# Altium schematic sheet Power supply and management.SchDoc
size A4; SheetNumber: 5; SheetTotal: 6
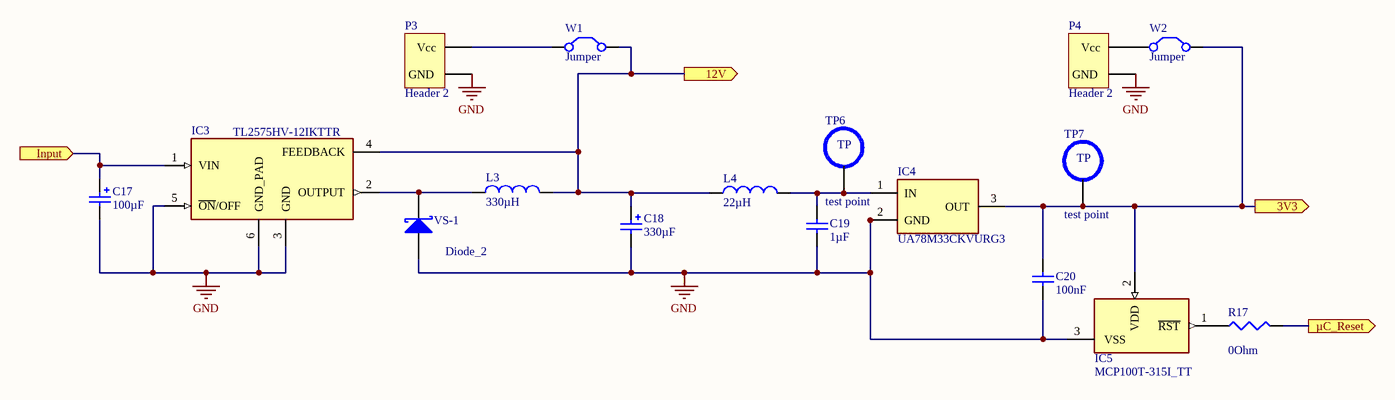
[diagram p0: Power supply and management.SchDoc]

## Parts
C17  100µF  [EEE0JA471UAP]
C18  330µF  [EEE0JA471UAP]
C19  1µF  [CAPC3216X180N]
C20  100nF  [CAPC3216X180N]
IC3  TL2575HV-12IKTTR  [TO170P1524X483-6N]
IC4  UA78M33CKVURG3  [TPS7A6533QKVURQ1]
IC5  MCP100T-315I_TT  [SOT96P237X112-3N]
L3  330µH  [B82464G4105M000]
L4  22µH  [INDPM6965X300N]
P3  Header 2  [HDR1X2]
P4  Header 2  [HDR1X2]
R17  value 0Ohm  [J1-0603]  (hidden comment: Res3)
TP6  test point  [Test point]
TP7  test point  [Test point]
VS-1  Diode_2  [DIOM5436X244N]
W1  Jumper  [RAD-0.2]
W2  Jumper  [RAD-0.2]

## Ports
3V3 (out), 12V (out), Input (in), µC_Reset (out)

## Nets
GND: C17.2 C18.2 C19.1 C20.1 IC3.3(GND) IC3.5(~{ON}/OFF) IC3.6(GND_PAD) IC4.2(GND) IC5.3(VSS) P3.?2(GND) P4.?2(GND) VS-1.3(A)
3V3: C20.2 IC4.3(OUT) IC5.2(VDD) TP7.5 W2.2(C2) ; port 3V3
12V: C18.1 IC3.4(FEEDBACK) L3.2 L4.1 W1.2(C2) ; port 12V
Input: C17.1 IC3.1(VIN) ; port Input
µC_Reset: R17.2 ; port µC_Reset
NetC19_2: C19.2 IC4.1(IN) L4.2 TP6.5
NetIC3_2: IC3.2(OUTPUT) L3.1 VS-1.1(K)
NetIC5_1: IC5.1(~{RST}) R17.1
NetP3_?1: P3.?1(Vcc) W1.1(C1)
NetP4_?1: P4.?1(Vcc) W2.1(C1)

## Notes on the sheet
- (in symbol test point) TP

## Library data of the parts
C17 = 100µF: Capacitor Polarised; Manufacturer_Name: Panasonic; Manufacturer_Part_Number: EEV-FK1K101V; Datasheet Link: http://industrial.panasonic.com/cdbs/www-data/pdf/RDE0000/ABA0000C1181.pdf; Height: 14.3mm; Mouser Part Number: 667-EEV-FK1K101V; Mouser Price/Stock: https://www.mouser.co.uk/ProductDetail/Panasonic/EEV-FK1K101V?qs=MtOUKumLmnbTFvRMlB7%2FdA%3D%3D; Value: 100µF
C18 = 330µF: Capacitor Polarised; Manufacturer_Name: Panasonic; Manufacturer_Part_Number: EEV-FK1K101V; Datasheet Link: http://industrial.panasonic.com/cdbs/www-data/pdf/RDE0000/ABA0000C1181.pdf; Height: 14.3mm; Mouser Part Number: 667-EEV-FK1K101V; Mouser Price/Stock: https://www.mouser.co.uk/ProductDetail/Panasonic/EEV-FK1K101V?qs=MtOUKumLmnbTFvRMlB7%2FdA%3D%3D; Value: 330µF
C19 = 1µF: Capacitor; Published: 8-Jun-2000; LatestRevisionDate: 17-Jul-2002; LatestRevisionNote: Re-released for DXP Platform.; PackageReference: RAD-0.3; Publisher: Altium Limited; PackageDescription: Radial Cap, Thru-Hole; 2 Leads; 0.3 in Pin Spacing; Value: 1µF
C20 = 100nF: Capacitor; Published: 8-Jun-2000; LatestRevisionDate: 17-Jul-2002; LatestRevisionNote: Re-released for DXP Platform.; PackageReference: RAD-0.3; Publisher: Altium Limited; PackageDescription: Radial Cap, Thru-Hole; 2 Leads; 0.3 in Pin Spacing; Value: 100nF
IC3 = TL2575HV-12IKTTR: Integrated Circuit; Manufacturer_Name: Texas Instruments; Datasheet Link: http://www.ti.com/lit/ds/symlink/tl2575-15.pdf; Height: 5.13mm; Manufacturer_Part_Number: TL2575HV-12IKTTR; Mouser Part Number: 595-TL2575HV-12IKTTR; Mouser Price/Stock: https://www.mouser.co.uk/ProductDetail/Texas-Instruments/TL2575HV-12IKTTR?qs=EnLMdcWnKADDmW7d51Om1g%3D%3D; Arrow Part Number: TL2575HV-12IKTTR; Arrow Price/Stock: https://www.arrow.com/en/products/tl2575hv-12ikttr/texas-instruments?region=nac
IC4 = UA78M33CKVURG3: Integrated Circuit; Manufacturer_Name: Texas Instruments; Datasheet Link: https://www.ti.com/lit/gpn/ua78m?HQS=ti-null-null-sf-df-pf-sep-wwe&DCM=yes; Height: 2.52mm; Manufacturer_Part_Number: UA78M33CKVURG3; Mouser Part Number: 595-UA78M33CKVURG3; Mouser Price/Stock: https://www.mouser.co.uk/ProductDetail/Texas-Instruments/UA78M33CKVURG3?qs=0O%2FZFlpUpJXrDg4gfD1Q2g%3D%3D; Arrow Part Number: UA78M33CKVURG3; Arrow Price/Stock: https://www.arrow.com/en/products/ua78m33ckvurg3/texas-instruments
IC5 = MCP100T-315I_TT: Integrated Circuit; Manufacturer_Name: Microchip; Manufacturer_Part_Number: MCP100T-315I/TT; Datasheet Link: http://docs-emea.rs-online.com/webdocs/0d03/0900766b80d034b8.pdf; Height: 1.12mm; Mouser Part Number: 579-MCP100T-315I/TT; Mouser Price/Stock: https://www.mouser.co.uk/ProductDetail/Microchip-Technology/MCP100T-315I-TT?qs=cQYLKLPzRJnnE4Sa6znIFg%3D%3D; Arrow Part Number: MCP100T-315I/TT; Arrow Price/Stock: https://www.arrow.com/en/products/mcp100t-315itt/microchip-technology?region=nac
L3 = 330µH: power inductor
L4 = 22µH: power inductor
P3 P4 = Header 2: Header, 2-Pin; LatestRevisionDate: 17-Jul-2002; LatestRevisionNote: Re-released for DXP Platform.; Publisher: Altium Limited
R17 = Res3: Resistor; Published: 8-Jun-2000; LatestRevisionDate: 29-May-2009; LatestRevisionNote: IPC-7351 Footprint Added.; PackageReference: J1-0603; Publisher: Altium Limited; PackageDescription: Chip Resistor
VS-1 = Diode_2: Schottky Rectifier / VS-10BQ060-M3/5BT; Note: Terminal 2 is the TAB and is electrically connected to the cathode; Published: 8-Jun-2000; LatestRevisionDate: 17-Jul-2002; LatestRevisionNote: Re-released for DXP Platform.; DatasheetVersion: PD-2.057B; PackageVersion: Feb-1998; PackageReference: TO-220AC; Publisher: Altium Limited; PackageDescription: TO, Thru-Hole, Vertical, Heatsink Mounted; 3 In-Line Leads (1 Absent); Pitch 2.54 mm; ComponentLink1Description: Manufacturer Link; ComponentLink1URL: http://www.irf.com/; ComponentLink2Description: Datasheet; ComponentLink2URL: http://www.irf.com/product-info/datasheets/data/10tq.pdf
W1 W2 = Jumper: Jumper Wire; Published: 24-Mar-1999; LatestRevisionDate: 17-Jul-2002; LatestRevisionNote: Re-released for DXP Platform.; PackageReference: RAD-0.2; Publisher: Altium Limited; PackageDescription: Radial Cap, Thru-Hole; 2 Leads; 0.2 in Pin Spacing